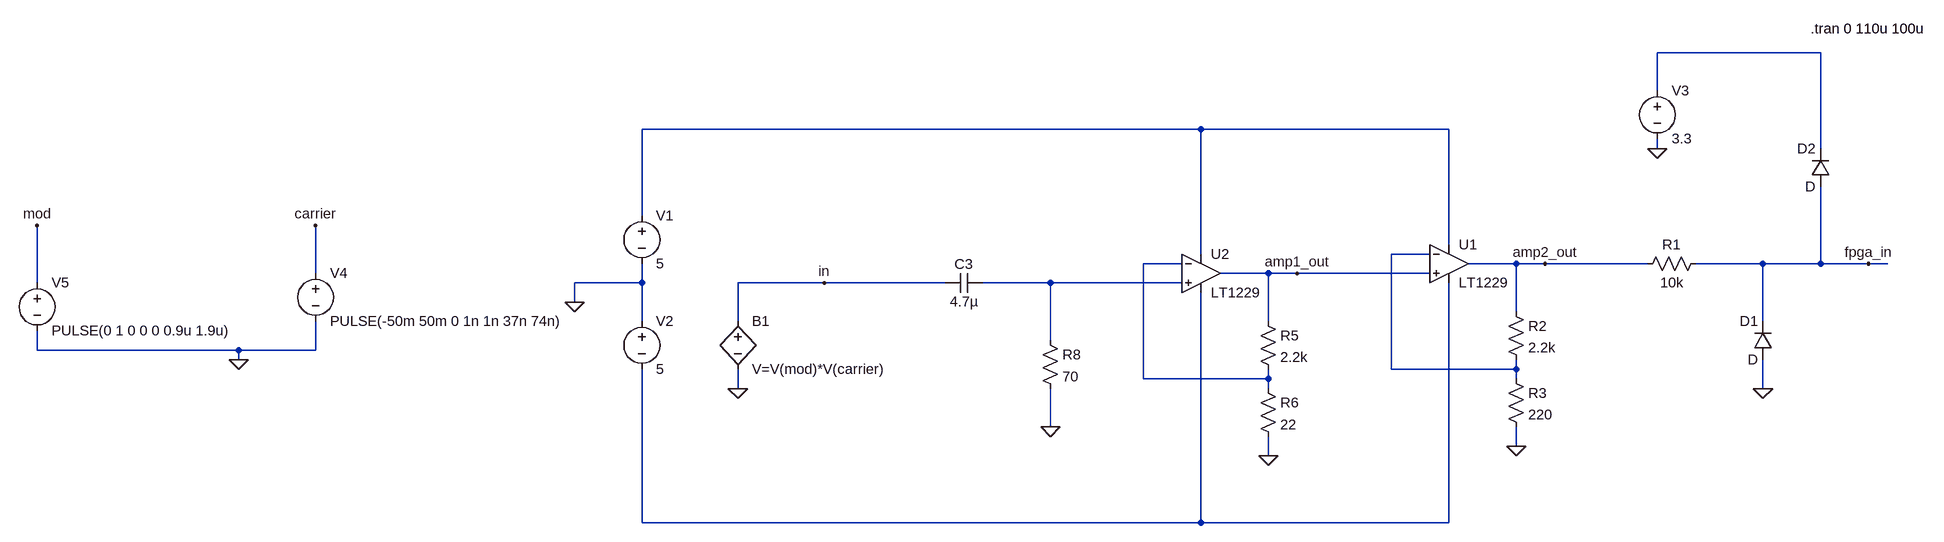
[diagram p0: schematic lt1229_cascaded_amp.asc]
lt1229_cascaded_amp.asc, the LTspice schematic file:
Version 4
SHEET 1 880 680
WIRE 80 -240 -192 -240
WIRE -192 -176 -192 -240
WIRE -1136 -112 -2560 -112
WIRE -576 -112 -1136 -112
WIRE -192 -80 -192 -96
WIRE 80 -80 80 -240
WIRE -2560 32 -2560 -112
WIRE -576 80 -576 -112
WIRE -1136 96 -1136 -112
WIRE -608 96 -672 96
WIRE -1168 112 -1232 112
WIRE -464 112 -544 112
WIRE -416 112 -464 112
WIRE -208 112 -416 112
WIRE -16 112 -128 112
WIRE 80 112 80 -16
WIRE 80 112 -16 112
WIRE 160 112 80 112
WIRE 192 112 160 112
WIRE -3104 128 -3104 48
WIRE -1024 128 -1104 128
WIRE -976 128 -1024 128
WIRE -608 128 -976 128
WIRE -3568 144 -3568 48
WIRE -2560 144 -2560 112
WIRE -2560 144 -2672 144
WIRE -2256 144 -2400 144
WIRE -1920 144 -2256 144
WIRE -1744 144 -1856 144
WIRE -1168 144 -1744 144
WIRE -2672 176 -2672 144
WIRE -464 192 -464 112
WIRE -2560 208 -2560 144
WIRE -2400 208 -2400 144
WIRE -1024 208 -1024 128
WIRE -16 208 -16 112
WIRE -1744 240 -1744 144
WIRE -3568 256 -3568 224
WIRE -3232 256 -3568 256
WIRE -3104 256 -3104 208
WIRE -3104 256 -3232 256
WIRE -3232 272 -3232 256
WIRE -672 288 -672 96
WIRE -464 288 -464 272
WIRE -464 288 -672 288
WIRE -1232 304 -1232 112
WIRE -1024 304 -1024 288
WIRE -1024 304 -1232 304
WIRE -464 304 -464 288
WIRE -2400 320 -2400 288
WIRE -1024 320 -1024 304
WIRE -16 320 -16 272
WIRE -1744 384 -1744 320
WIRE -464 416 -464 384
WIRE -1024 432 -1024 400
WIRE -2560 544 -2560 288
WIRE -1136 544 -1136 160
WIRE -1136 544 -2560 544
WIRE -576 544 -576 144
WIRE -576 544 -1136 544
FLAG -2672 176 0
FLAG -2400 320 0
FLAG -3232 272 0
FLAG -3568 48 mod
FLAG -3104 48 carrier
FLAG -2256 144 in
FLAG -1024 432 0
FLAG -1744 384 0
FLAG -976 128 amp1_out
FLAG -16 320 0
FLAG -192 -80 0
FLAG 160 112 fpga_in
FLAG -464 416 0
FLAG -416 112 amp2_out
SYMBOL voltage -2560 16 R0
WINDOW 123 0 0 Left 2
WINDOW 39 0 0 Left 2
SYMATTR InstName V1
SYMATTR Value 5
SYMBOL voltage -2560 192 R0
WINDOW 123 0 0 Left 2
WINDOW 39 0 0 Left 2
SYMATTR InstName V2
SYMATTR Value 5
SYMBOL voltage -3104 112 R0
WINDOW 123 0 0 Left 2
WINDOW 39 0 0 Left 2
SYMATTR InstName V4
SYMATTR Value PULSE(-50m 50m 0 1n 1n 37n 74n)
SYMBOL voltage -3568 128 R0
WINDOW 123 0 0 Left 2
WINDOW 39 0 0 Left 2
SYMATTR InstName V5
SYMATTR Value PULSE(0 1 0 0 0 0.9u 1.9u)
SYMBOL bv -2400 192 R0
SYMATTR InstName B1
SYMATTR Value V=V(mod)*V(carrier)
SYMBOL Opamps\\LT1229 -1136 64 R0
SYMATTR InstName U2
SYMBOL res -1760 224 R0
SYMATTR InstName R8
SYMATTR Value 70
SYMBOL cap -1856 128 R90
WINDOW 0 0 32 VBottom 2
WINDOW 3 32 32 VTop 2
SYMATTR InstName C3
SYMATTR Value 4.7µ
SYMBOL res -1040 192 R0
SYMATTR InstName R5
SYMATTR Value 2.2k
SYMBOL res -1040 304 R0
SYMATTR InstName R6
SYMATTR Value 22
SYMBOL diode 0 272 R180
WINDOW 0 24 64 Left 2
WINDOW 3 24 0 Left 2
SYMATTR InstName D1
SYMBOL diode 96 -16 R180
WINDOW 0 24 64 Left 2
WINDOW 3 24 0 Left 2
SYMATTR InstName D2
SYMBOL res -112 96 R90
WINDOW 0 0 56 VBottom 2
WINDOW 3 32 56 VTop 2
SYMATTR InstName R1
SYMATTR Value 10k
SYMBOL voltage -192 -192 R0
WINDOW 123 0 0 Left 2
WINDOW 39 0 0 Left 2
SYMATTR InstName V3
SYMATTR Value 3.3
SYMBOL Opamps\\LT1229 -576 48 R0
SYMATTR InstName U1
SYMBOL res -480 176 R0
SYMATTR InstName R2
SYMATTR Value 2.2k
SYMBOL res -480 288 R0
SYMATTR InstName R3
SYMATTR Value 220
TEXT 64 -280 Left 2 !.tran 0 110u 100u

The netlist it stands for:
* lt1229_cascaded_amp.asc
V1 N002 0 5
V2 0 N006 5
V4 carrier 0 PULSE(-50m 50m 0 1n 1n 37n 74n)
V5 mod 0 PULSE(0 1 0 0 0 0.9u 1.9u)
B1 in 0 V=V(mod)*V(carrier)
XU2 N005 N004 N002 N006 amp1_out LT1229  ; pins In+ In- V+ V- OUT
R8 N005 0 70
C3 N005 in 4.7µ
R5 amp1_out N004 2.2k
R6 N004 0 22
D1 0 fpga_in D
D2 fpga_in N001 D
R1 fpga_in amp2_out 10k
V3 N001 0 3.3
XU1 amp1_out N003 N002 N006 amp2_out LT1229  ; pins In+ In- V+ V- OUT
R2 amp2_out N003 2.2k
R3 N003 0 220
.model D D
.lib standard.dio
.tran 0 110u 100u
.backanno
.end